# EAGLE schematic LPC_LCD_V098_0 (EAGLE 6.2)
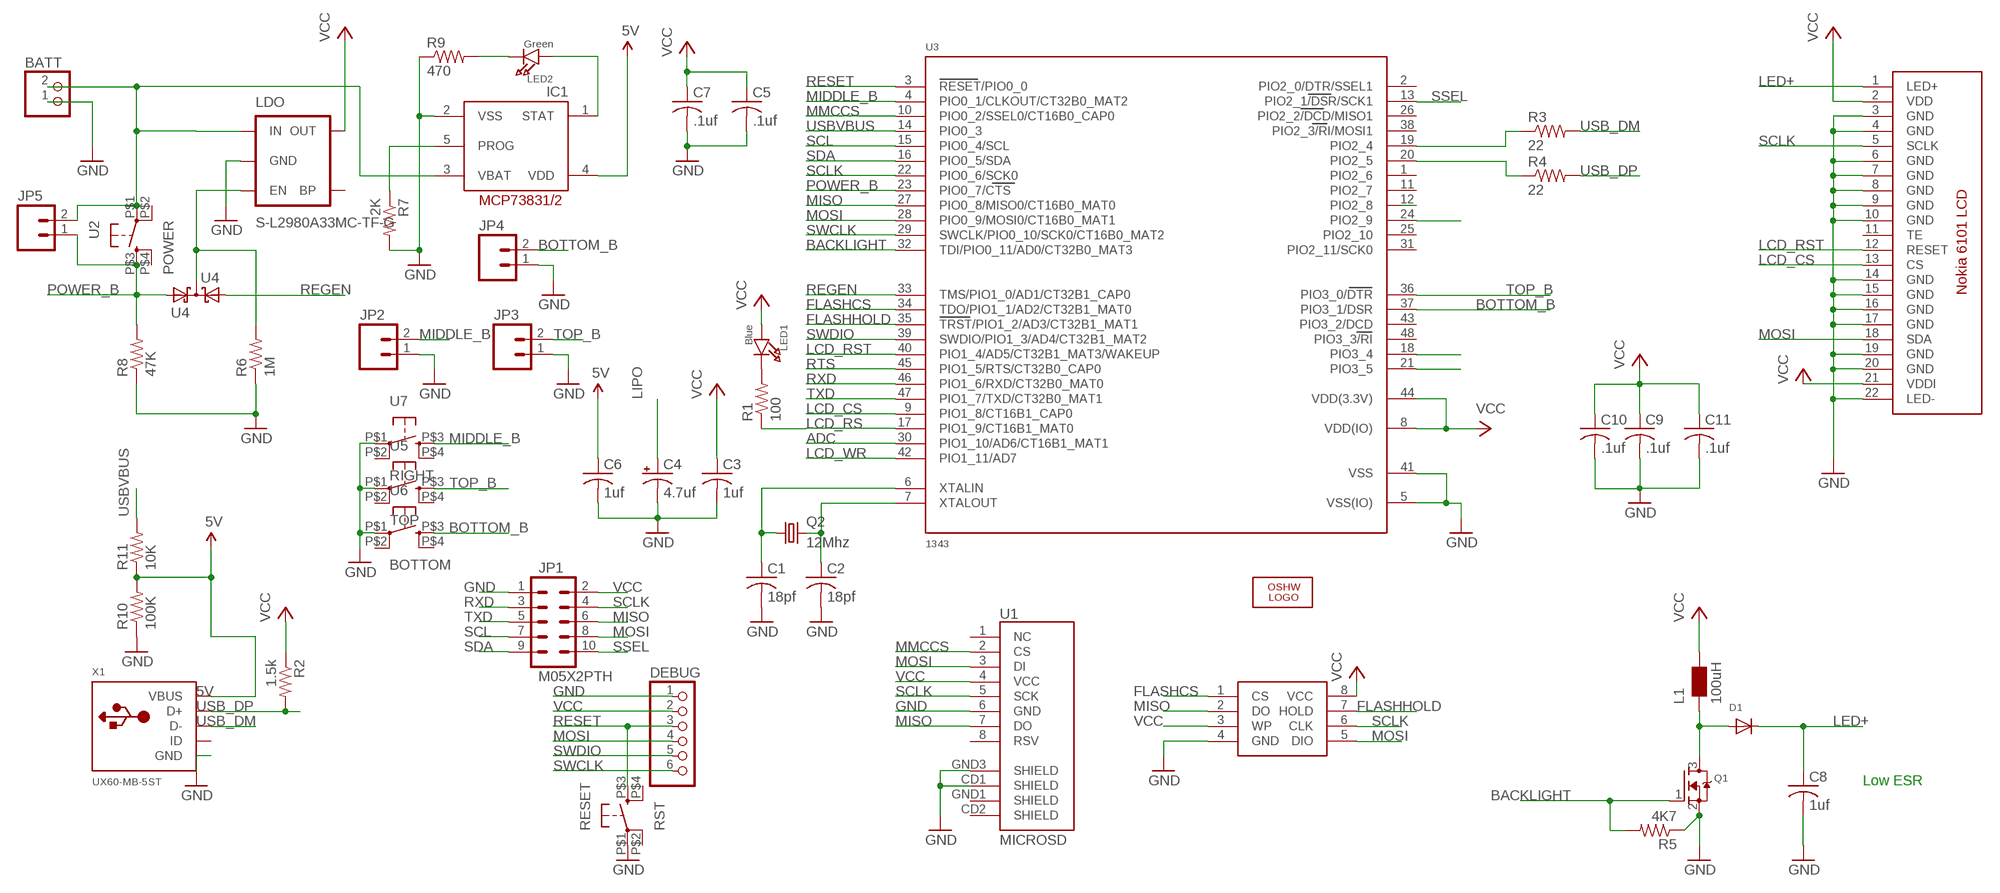
[diagram p0: schematic, sheet 1]

## Parts
BATT  JST_2PIN-SMT  [JST-PH-2-SMT]
C1  18pf  C-USC0805  [C0805]
C2  18pf  C-USC0805  [C0805]
C3  1uf  C-USC0805  [C0805]
C4  4.7uf  CAP_POL1206  [EIA3216]
C5  .1uf  C-USC0805  [C0805]
C6  1uf  C-USC0805  [C0805]
C7  .1uf  C-USC0805  [C0805]
C8  1uf  C-USC0805  [C0805]
C9  .1uf  C-USC0805  [C0805]
C10  .1uf  C-USC0805  [C0805]
C11  .1uf  C-USC0805  [C0805]
D1  DIODESOD-123  [SOD-123]
DEBUG  HEADER-1X6ROUND  [1X06_ROUND]
IC1  MCP73831  MCP73831/OT  [SOT23-5L]
JP1  M05X2PTH  [AVR_ICSP]
JP2  M02LOCK  [1X02_LOCK]
JP3  M02LOCK  [1X02_LOCK]
JP4  M02LOCK  [1X02_LOCK]
JP5  M02LOCK  [1X02_LOCK]
L1  100uH  WE-KIHQ_1008  [WE-KI_1008_B]
LDO  S-L2980A33MC-TF-G  V_REG_LDOSMD  [SOT23-5]
LED1  Blue  LED0805  [CHIPLED_0805]
LED2  Green  LED0805  [CHIPLED_0805]
LOGO1  OSHW_LOGO_FILLX0350-NT  [OSHW_FILLX350_NOTEXT]
Q1  MOSFET-NREFLOW  [SOT23-R]
Q2  12Mhz  CRYSTAL5X3  [CRYSTAL-SMD-5X3]
R1  100  R-US_M0805  [M0805]
R2  1.5k  R-US_M0805  [M0805]
R3  22  R-US_M0805  [M0805]
R4  22  R-US_M0805  [M0805]
R5  4K7  R-US_M0805  [M0805]
R6  1M  R-US_M0805  [M0805]
R7  2K  R-US_M0805  [M0805]
R8  47K  R-US_M0805  [M0805]
R9  470  R-US_M0805  [M0805]
R10  100K  R-US_M0805  [M0805]
R11  10K  R-US_M0805  [M0805]
RESET  RST  SWITCH_KMR4  [SWITCH_KMR4]
U1  MICROSD  USD-SOCKETNEW  [MICRO-SD-SOCKET-PP]
U2  POWER  KMS_SWITCHSWITCH_KMS_WIDE_HAND  [SWITCH_KMS_WIDE]
U3  1343  LPC1113/4  [LQFP48]
U4  U4  BAT54CWT1G  [SOT23]
U5  TOP  KMS_SWITCHSWITCH_KMS_WIDE_HAND  [SWITCH_KMS_WIDE]
U6  BOTTOM  KMS_SWITCHSWITCH_KMS_WIDE_HAND  [SWITCH_KMS_WIDE]
U7  RIGHT  KMS_SWITCHSWITCH_KMS_WIDE_HAND  [SWITCH_KMS_WIDE]
U$1  spiflash  SPIFLASH  [SOIC8]
U$3  PETERATMEGA644_NOKIA6101_LCD  [PETERATMEGA644_NOKIA6101_LCD]
X1  UX60-MB-5ST  USBMINIB  [USB-MINIB]

## Nets
5V [power]: C6.1 IC1.4(VDD) R10.2 R11.1 X1.VBUS
ADC: U3.30(PIO1_10/AD6/CT16B1_MAT1)
BACKLIGHT: Q1.1(G) R5.2 U3.32(TDI/PIO0_11/AD0/CT32B0_MAT3)
BOTTOM_B: JP4.2 U3.37(PIO3_1/DSR) U6.P$3
DB4: U3.18(PIO3_4)
DB5: U3.21(PIO3_5)
EN: LDO.3(EN) R6.2 U4.3(AA)
FLASHCS: U3.34(TDO/PIO1_1/AD2/CT32B1_MAT0) U$1.1(CS)
FLASHHOLD: U3.35(TRST/PIO1_2/AD3/CT32B1_MAT1) U$1.7(HOLD)
GND [power]: BATT.1 C1.2 C2.2 C3.2 C4.C(-) C5.2 C6.2 C7.2 C8.2 C9.2 C10.2 C11.2 DEBUG.1 IC1.2(VSS) JP1.1 JP2.1 JP3.1 JP4.1 LDO.2(GND) Q1.2(S) R5.1 R6.1 R7.2 R8.1 R9.1 R10.1 RESET.P$1 U1.6(GND) U1.CD1(SHIELD) U1.GND3(SHIELD) U3.5(VSS(IO)) U3.41(VSS) U5.P$1 U6.P$1 U7.P$1 U$1.4(GND) U$3.3(GND) U$3.4(GND) U$3.6(GND) U$3.7(GND) U$3.8(GND) U$3.9(GND) U$3.10(GND) U$3.14(GND) U$3.15(GND) U$3.16(GND) U$3.17(GND) U$3.19(GND) U$3.20(GND) U$3.22(LED-) X1.GND
LCD_CS: U3.9(PIO1_8/CT16B1_CAP0) U$3.13(CS)
LCD_RS: R1.1 U3.17(PIO1_9/CT16B1_MAT0)
LCD_RST: U3.40(PIO1_4/AD5/CT32B1_MAT3/WAKEUP) U$3.12(RESET)
LCD_WR: U3.42(PIO1_11/AD7)
LED+ [power]: C8.1 D1.C U$3.1(LED+)
LIPO [power]: BATT.2 C4.A(+) IC1.3(VBAT) JP5.2 LDO.1(IN) U2.P$1
MIDDLE_B: JP2.2 U3.4(PIO0_1/CLKOUT/CT32B0_MAT2) U7.P$3
MISO: JP1.6 U1.7(DO) U3.27(PIO0_8/MISO0/CT16B0_MAT0) U$1.2(DO)
MMCCS: U1.2(CS) U3.10(PIO0_2/SSEL0/CT16B0_CAP0)
MOSI: DEBUG.4 JP1.8 U1.3(DI) U3.28(PIO0_9/MOSI0/CT16B0_MAT1) U$1.5(DIO) U$3.18(SDA)
N$1: C2.1 Q2.3 U3.7(XTALOUT)
N$2: R3.1 U3.19(PIO2_4)
N$3: R4.1 U3.20(PIO2_5)
N$4: LED1.C R1.2
N$5: U3.12(PIO2_8)
N$6: D1.A L1.2 Q1.3(D)
N$7: IC1.5(PROG) R7.1
N$8: IC1.1(STAT) LED2.A
N$9: LED2.C R9.2
N$10: U3.24(PIO2_9)
POWER_B: JP5.1 R8.2 U2.P$3 U3.23(PIO0_7/CTS) U4.2(K1)
REGEN: U3.33(TMS/PIO1_0/AD1/CT32B1_CAP0) U4.1(K2)
RESET: DEBUG.3 RESET.P$3 U3.3(RESET/PIO0_0)
RTS: U3.45(PIO1_5/RTS/CT32B0_CAP0)
RXD: JP1.3 U3.46(PIO1_6/RXD/CT32B0_MAT0)
SCL: JP1.7 U3.15(PIO0_4/SCL)
SCLK: JP1.4 U1.5(SCK) U3.22(PIO0_6/SCK0) U$1.6(CLK) U$3.5(SCLK)
SDA: JP1.9 U3.16(PIO0_5/SDA)
SSEL: JP1.10 U3.13(PIO2_1/DSR/SCK1)
SWCLK: DEBUG.6 U3.29(SWCLK/PIO0_10/SCK0/CT16B0_MAT2)
SWDIO: DEBUG.5 U3.39(SWDIO/PIO1_3/AD4/CT32B1_MAT2)
TOP_B: JP3.2 U3.36(PIO3_0/DTR) U5.P$3
TXD: JP1.5 U3.47(PIO1_7/TXD/CT32B0_MAT1)
USB_DM: R3.2 X1.D-
USB_DP: R2.2 R4.2 X1.D+
USBVBUS [power]: R11.2 U3.14(PIO0_3)
VCC [power]: C3.1 C5.1 C7.1 C9.1 C10.1 C11.1 DEBUG.2 JP1.2 L1.1 LDO.5(OUT) LED1.A R2.1 U1.4(VCC) U3.8(VDD(IO)) U3.44(VDD(3.3V)) U$1.3(WP) U$1.8(VCC) U$3.2(VDD) U$3.21(VDDI)
XTAL1: C1.1 Q2.1 U3.6(XTALIN)
Unconnected: LDO.4(BP) RESET.P$2 RESET.P$4 U1.1(NC) U1.8(RSV) U1.CD2(SHIELD) U1.GND1(SHIELD) U2.P$2 U2.P$4 U3.1(PIO2_6) U3.2(PIO2_0/DTR/SSEL1) U3.11(PIO2_7) U3.25(PIO2_10) U3.26(PIO2_2/DCD/MISO1) U3.31(PIO2_11/SCK0) U3.38(PIO2_3/RI/MOSI1) U3.43(PIO3_2/DCD) U3.48(PIO3_3/RI) U5.P$2 U5.P$4 U6.P$2 U6.P$4 U7.P$2 U7.P$4 U$3.11(TE) X1.ID

## Notes on the sheet
- Low ESR

## Library data of the parts
BATT = mylib:JST_2PIN: JST 2-Pin Connectors of various flavors SMT-RA (S2B-PH-SM4) 4UConnector #17311 SMT (B2B-PH-SM4) THM-RA (S2B-PH) THM (B2B-PH)
C1-C3 C5-C11 = adafruit:C-US: CAPACITOR, American symbol
C4 = SparkFun:CAP_POL: Capacitor Polarized These are standard SMD and PTH capacitors. Normally 10uF, 47uF, and 100uF in electrolytic and tantalum varieties. Always verify the external diameter of the through hole cap, it varies with capacity, voltage, and manufacturer. The EIA devices should be standard.
D1 = microbuilder:DIODE: Diode SMADIODE - SMA Surface Mount Package 20V 1A Schottky Diode Digikey (500mV @ 1A, 500uA Vr @ 20V): 641-1014-6-ND 10V 2A Schottky Diode Digikey (350mV @ 2A, 700uA Vr @ 10V): MBRA210LT3 SOD-123 30V 200mA (800mV Vf, 2uA Vr @ 25V) Schottky Diode (very fast switching for boost, etc.) - Digikey: BAT54T1GOSTR-ND 30V 500mA (430mV Vf, 130uA Vr @ 30V) Schottky Diode - Digikey: B0530W-FDICT-ND MBR120 1A 20V (0.34Vf) Schottky Diode - Digikey: MBR120VLSFT1GOSCT-ND SOD-323 10V 570mA (380mV Vf, 3ns) Schottky Diode - Digikey: ZLLS410CT-ND 1N4148WS - 75V 150mA (1V Vf @ 10mA, 4ns) Simple Diode - Digikey: 1N4148WSFSCT-ND, Mouser: 512-1N4148WS SOD-523 BAT54 30V 200mA Schottky (0.8 Vf @ 100mA, 5ns) - Digikey: BAT54XV2CT-ND 30V 30mA Schottky Diode (RB751S-40TE61) - Digikey: RB751S-40TE61CT-ND SOT23-R/W - SOT23 Package (R = Solder Paste/Reflow Ovens, W = Hand-Soldering) BAT54Film 40V 300mA - Digikey: 497-7162-1-ND DO-1N4148 Through Hole Small Current Diode (any model)
DEBUG = microbuilder:HEADER-1X6: PIN HEADER
IC1 = adafruit:MCP73831: MCP73831/2 Miniature Single-Cell, Fully Integrated Li-Ion, Li-Polymer Charge Management Controllers. Nice and small simple lipoly charge controller, with adjustable current and status output (LED) http://www.ladyada.net/library/pcb/eaglelibrary.html
JP1 = SparkFun:M05X2: Header 5x2 Standard 10-pin dual row 0.1" header. Commonly used with AVR-ISP. Use with Spark Fun Electronics SKU: PRT-00778
JP2-JP5 = SparkFun:M02: Header 2 Standard 2-pin 0.1" header. Use with straight break away headers (SKU : PRT-00116), right angle break away headers (PRT-00553), swiss pins (PRT-00743), machine pins (PRT-00117), and female headers (PRT-00115). Molex polarized connector foot print use with SKU : PRT-08233 with associated crimp pins and housings.
L1 = PeterAtMega644:WE-KIHQ: SMD Wire Wound Ceramic Inductor WE-KIHQ - High current - Highest Quality factor in size 0805 - up to 98 - High thermal stability - High SRF -- Bluetooth -- Wireless LAN -- RF oscillation circuit -- IF impedance matching -- IG choke
LDO = PeterAtMega644:V_REG_LDO: Voltage Regulator LDO Standard 150mA LDO voltage regulator in SOT-23 layout. Micrel part MIC5205. BP (by-pass) pin is used to lower output noise with 470pF cap.
LED1 LED2 = microbuilder:LED: LED 0603 - 0603 Surface Mount Package 2mA: Green LED - Low Power (3.9mcd, 2ma, 1.7Vf) - Digikey: 475-2709-2-ND Orange LED - Low Power (9.8mcd, 2ma, 1.8Vf) - Digikey: 475-1194-2-ND Red LED - Low Power (5mcd, 2ma, 1.8Vf) - Digikey: 475-1195-2-ND Yellow LED - Low Power (7mcd, 2ma, 1.8Vf) - Digikey: 475-1196-2-ND 5mA: Blue LED - Low Power (17mcd, 5ma, 2.9Vf) - Digikey: LNJ937W8CRACT-ND 0805 - 0805 Surface Mount Package 2mA: Red LED (8.8mcd, 2mA, 1.8Vf, Clear) - Low Power [Digikey: 475-2510-1-ND] Green LED (5mcd, 2mA, 1.8Vf, Clear) - Low Power [Digikey: 475-2730-1-ND] Yellow LED (11.3mcd, 2mA, 1.8Vf, Clear) - Low Power [Digikey: 475-2555-1-ND] 20mA: Red LED (104mcd, 20mA, Diffused) - LS R976 [Digikey: 475-1278-6-ND] Red LED (12mcd, 20mA, 2.0Vf, Clear) - APT2012EC [Digikey: 754-1128-1-ND] Green LED (15mcd, 20mA, 2.2Vf, Clear) - APT2012GC [Digikey: 754-1131-1-ND] Orange LED (160mcd, 20mA, 2.1Vf, Clear) - APT2012SECK [Digikey: 754-1130-1-ND] 1206 - 1206 Surface Mount Package Green LED (26mcd, 20mA, Diffused) - LG N971 [Digikey: 475-1407-6-ND] Red LED (15mcd, 20mA, Diffused) - LH N974 [Digikey: 475-1416-6-ND]
LOGO1 = ohw-logo:OSHW_LOGO_FILL
Q1 = microbuilder:MOSFET-N: N-Channel Mosfet 2N7002E - 60V 260mA SOT23 [Digikey: 2N7002ET1GOSTR-ND] BSH103 - 30V 850mA SOT23 [Digikey: 568-5013-1-ND]
Q2 = mylib:CRYSTAL: Crystals Various standard crystals. Proven footprints. Spark Fun Electronics SKU : COM-00534
R1-R11 = adafruit:R-US_: RESISTOR, American symbol
RESET = mylib:SWITCH_KMR4: KMS4 Series C&K tactile switch
U1 = SparkFun:USD-SOCKET: microSD Socket Push-push type uSD socket. Schematic element and footprint production proven. Spark Fun Electronics SKU : PRT-00127. tDoc lines correctly indicate media card edge positions when inserting (unlocked, locked, depressed).
U2 U5-U7 = mylib:KMS_SWITCH: KMS C&S Side actuated switch
U3 = microbuilder:LPC1113/4: LPC1113/4 MCU QFP48 Package ARM Cortex M0, 50MHz Operation, 8 Channel 10-Bit ADC, 1²C, 2xSPI, UART, 2x16 Bit and 2x32 Bit Timers, Internal 12MHz Oscillator, 1.8-3.6V operation. Model Flash SRAM Part N°: Digikey Mouser LPC1113 24KB 8KB LPC1113FBD48/301 TBD TBD LPC1114 32KB 8KB LPC1114FBD48/301 568-4950-ND 771-LPC1114FBD483011; DIGIKEY#: 568-4950-ND; MANF: NXP; MANF#: LPC1114FBD48/301,1
U4 = PeterAtMega644:BAT54CWT1G
U$1 = PeterAtMega644:SPIFLASH
U$3 = hirosecon:PETERATMEGA644_NOKIA6101_LCD: Serial Config for Nokia 6100 Display
X1 = adafruit:USB: USB Connectors USBMINIB - Surface Mount Female Mini-B USB Connector 4UConnector: 06564 By microbuilder.eu Thru-hole RA Female Mini-B USB Connector 4UConnector: 18732 By ladyada.net

## Net classes
0 default: width 0.152 mm, drill 0.305 mm, clearance 0.152 mm
1 power: width 0.152 mm, drill 0.305 mm, clearance 0.152 mm